# EAGLE design multi-pcb-power (EAGLE 9.6.2)
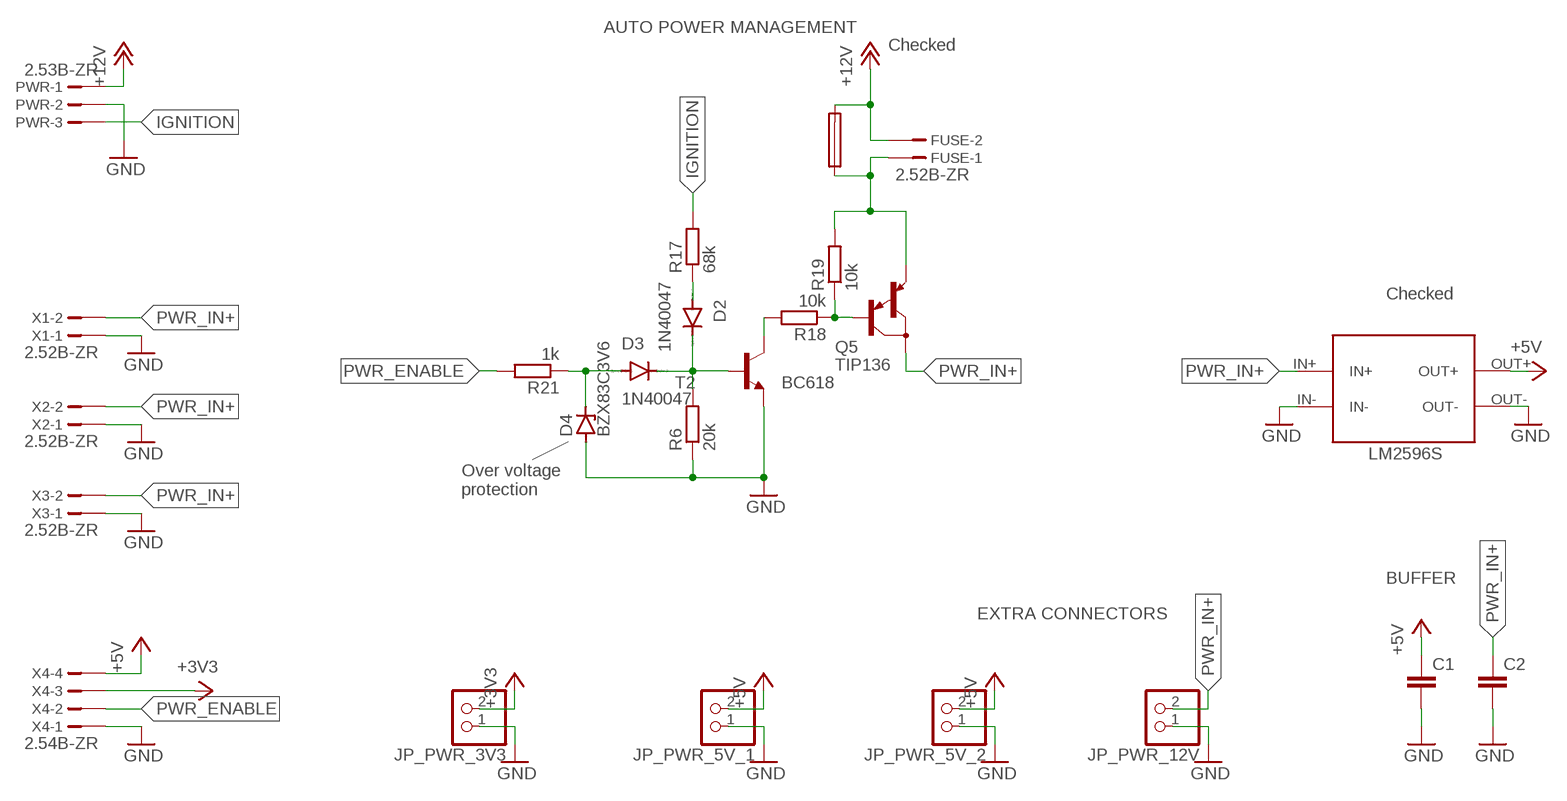
[diagram p0: schematic, sheet 1]

## Parts
C1  C-EU050-075X075  [C050-075X075]
C2  C-EU050-075X075  [C050-075X075]
D2  1N40047  [DO41-7.6]
D3  1N40047  [DO41-7.6]
D4  BZX83C3V6  BZX857  [DO41Z7.6]
FUSE  2.52B-ZR  [B2B-ZR2.5]
JP_PWR_3V3  PINHD-1X2  [1X02]
JP_PWR_5V_1  PINHD-1X2  [1X02]
JP_PWR_5V_2  PINHD-1X2  [1X02]
JP_PWR_12V  PINHD-1X2  [1X02]
PWR  2.53B-ZR  [B3B-ZR2.5]
Q5  TIP136  [TO220]
R6  20k  R-EU_0207/7  [0207/7]
R17  68k  R-EU_0207/7  [0207/7]
R18  10k  R-EU_0207/7  [0207/7]
R19  10k  R-EU_0207/7  [0207/7]
R21  1k  R-EU_0207/7  [0207/7]
T2  BC618  [TO92-EBC]
U$1  FUSE  [FB-5X20]
U$4  LM2596S  [LM2596S]
X1  2.52B-ZR  [B2B-ZR2.5]
X2  2.52B-ZR  [B2B-ZR2.5]
X3  2.52B-ZR  [B2B-ZR2.5]
X4  2.54B-ZR  [B4B-ZR2.5]

## Nets
+3V3: JP_PWR_3V3.2 X4.3
+5V: C1.1 JP_PWR_5V_1.2 JP_PWR_5V_2.2 U$4.OUT+ X4.4
+12V: FUSE.2 PWR.1 U$1.P$3 U$1.P$4
GND: C1.2 C2.2 D4.A JP_PWR_3V3.1 JP_PWR_5V_1.1 JP_PWR_5V_2.1 JP_PWR_12V.1 PWR.2 R6.1 T2.E U$4.IN- U$4.OUT- X1.1 X2.1 X3.1 X4.1
IGNITION: PWR.3 R17.2
N$5: D2.C D3.C R6.2 T2.B
N$11: D3.A D4.C R21.1
N$12: D2.A R17.1
N$14: Q5.1(B) R18.1 R19.1
N$15: R18.2 T2.C
N$21: FUSE.1 Q5.3(E) R19.2 U$1.P$1 U$1.P$2
PWR_ENABLE: R21.2 X4.2
PWR_IN+: C2.1 JP_PWR_12V.2 Q5.2(C) U$4.IN+ X1.2 X2.2 X3.2

## Notes on the sheet
- AUTO POWER MANAGEMENT
- Checked
- Checked
- Over voltage
  protection
- BUFFER
- EXTRA CONNECTORS

## Library data of the parts
C1 C2 = rcl:C-EU: CAPACITOR, European symbol; SPICEPREFIX: C
D2 D3 = diode-custom:1N4004: DIODE general purpose rectifier, 1 A
D4 = diode-custom:BZX85: Z DIODE
FUSE X1-X3 = con-jst-custom:?2B-ZR: ZH CONNECTOR 1.5 mm, 4 pin 1 row Source: http://www.jst.com .. eZH.pdf
JP_PWR_3V3 JP_PWR_5V_1 JP_PWR_5V_2 JP_PWR_12V = pinhead:PINHD-1X2: PIN HEADER
PWR = con-jst-custom:?3B-ZR: ZH CONNECTOR 1.5 mm, 4 pin 1 row Source: http://www.jst.com .. eZH.pdf
Q5 = transistor-pnp:TIP136: PNP Darlington Transistor
R6 R17-R19 R21 = rcl:R-EU_: RESISTOR, European symbol; SPICEPREFIX: R
T2 = transistor-npn:BC618*: NPN Transistor
U$1 = samuel:FUSE
U$4 = samuel:LM2596S
X4 = con-jst-custom:?4B-ZR: ZH CONNECTOR 1.5 mm, 4 pin 1 row Source: http://www.jst.com .. eZH.pdf

## Board
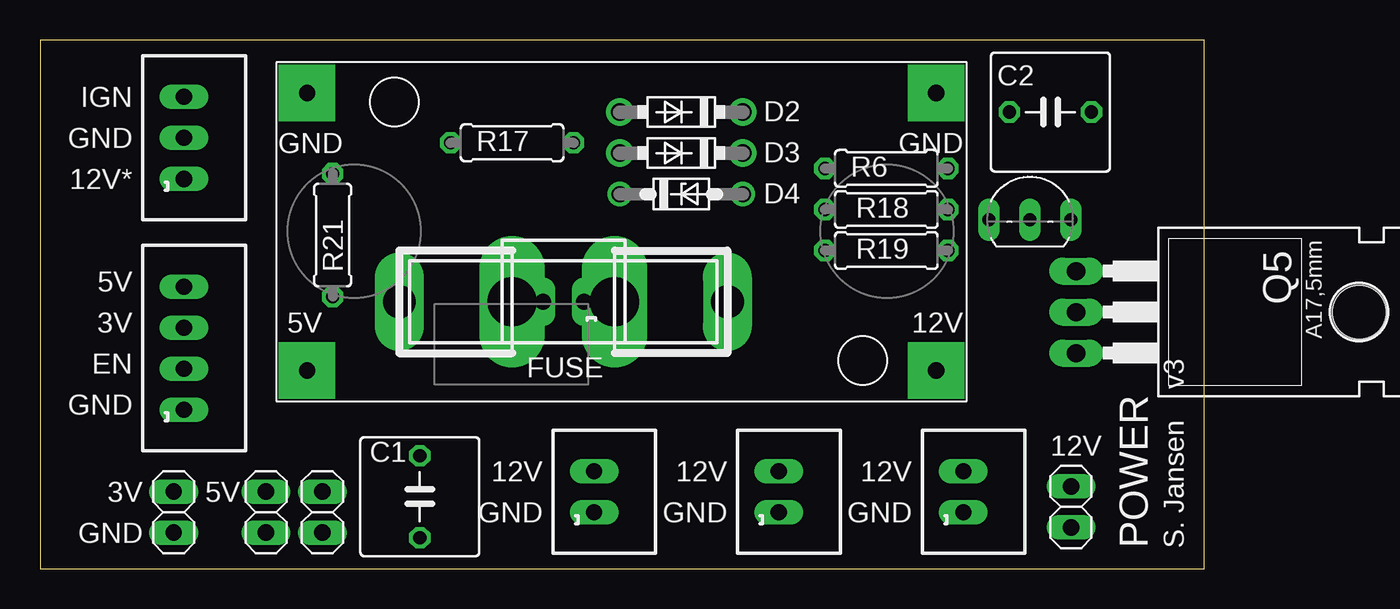
[diagram p1: board, top side]
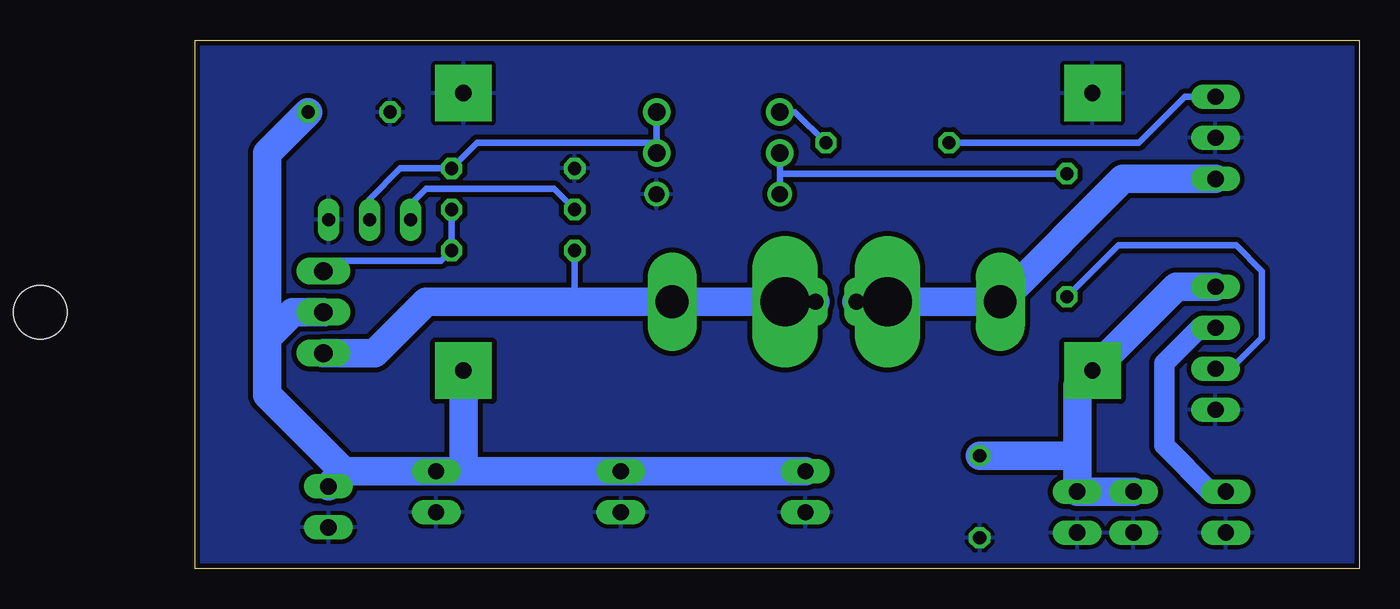
[diagram p2: board, bottom side, seen from below]

Size 72.06 x 32.69 mm. Coordinates in mm from the lower left corner, seen from the top.
Outline: 0,0 72.06,0 72.06,32.69 0,32.69 0,0
Copper layers (1*16): Top 0.035mm / dielectric 1.5mm / Bottom 0.035mm
Design rules "home-made-pcb *": minimum track width 8mil, minimum drill 0.3mm, track to track 12mil, track to pad 8mil, pad to pad 10mil, via to via 10mil, smd to smd 6mil, copper to edge 8mil, drill to drill 10mil, minimum pad ring 10mil, minimum via ring 20mil, stop-mask expansion 4mil, vias tented up to drill 0mil, thermal gap 10mil

### Footprints (pad centres in the part's own frame; a part is rotated, then mirrored left to right if it is on the bottom)
C050-075X075 = drill 0.813 octagon: 1 -2.54,0; 2 2.54,0
DO41-7.6 = drill 1.1 pad 1.7: A 3.81,0; C -3.81,0
DO41Z7.6 = drill 1: A 3.81,0; C -3.81,0
B2B-ZR2.5 = drill 1 pad 1.422 long: 1 -1.285,0; 2 1.257,0
1X02 = drill 1.016 long: 1 -1.27,0; 2 1.27,0
B3B-ZR2.5 = drill 1 pad 1.422 long: 1 -2.555,0; 2 -0.013,0; 3 2.527,0
TO220 = drill 1.118 long: 1 -2.54,-6.35; 2 0,-6.35; 3 2.54,-6.35 | hole 3.302: 0,11.176
0207/7 = drill 0.813 octagon: 1 -3.81,0; 2 3.81,0
TO92-EBC = drill 0.813 long: B 0,-1.27; C -2.54,-1.27; E 2.54,-1.27
FB-5X20 = drill 2.032 long: P$1 -10.16,0; P$4 10.16,0 | drill 3.048 long: P$2 -3.175,0; P$3 3.175,0
LM2596S = drill 1 pad 3.5 square: IN+ -19.633,8.963; IN- -19.633,-8.213; OUT+ 19.323,8.963; OUT- 19.323,-8.213
B4B-ZR2.5 = drill 1 pad 1.422 long: 1 -3.825,0; 2 -1.283,0; 3 1.257,0; 4 3.797,0

### Placement (x,y rotation side)
C1  23.5,4.45 270 top
C2  62.55,28.26 180 top
D2  39.69,28.26 180 top
D3  39.69,25.72 180 top
D4  39.69,23.18 0 top
FUSE  32.38,16.51 180 top
JP_PWR_3V3  8.26,3.49 90 top
JP_PWR_5V_1  17.46,3.49 90 top
JP_PWR_5V_2  13.97,3.49 90 top
JP_PWR_12V  63.82,3.81 90 top
PWR  8.89,26.67 90 top
Q5  70.48,15.88 270 top
R6  52.39,24.77 0 top
R17  29.21,26.35 180 top
R18  52.39,22.23 180 top
R19  52.39,19.68 180 top
R21  18.1,20.64 270 top
T2  61.28,22.86 0 top
U$1  32.38,16.51 180 top
U$4  35.83,21.22 180 top
X1  57.15,4.76 90 top
X2  34.29,4.76 90 top
X3  45.72,4.76 90 top
X4  8.89,13.65 90 top

### Tracks (layer width: path | path; a pad name or v marks a point on that pad's centre or on a via)
+3V3
  Bottom 1.27: X4.3 9.86,14.91 12.06,12.7 12.06,7.62 9.21,4.76 JP_PWR_3V3.2
+5V
  Bottom 1.778: X4.4 11.32,17.45 U$4.OUT+ 17.46,11.3 17.46,6.99 | 17.46,6.99 JP_PWR_5V_1.2 JP_PWR_5V_2.2 | C1.1 17.46,6.99
+12V
  Bottom 1.778: FUSE.2 U$1.P$3 U$1.P$4 14.62,24.11 PWR.1
GND
  pour Bottom (isolate 0.305): -0.64,43.81 -0.64,-0.64 73.03,-0.64 73.03,43.81
  pour Bottom (isolate 0.305): -0.95,-0.95 74.3,-0.95 74.3,35.56 -0.95,35.56
IGNITION
  Bottom 0.406: PWR.3 10.81,29.2 13.65,26.35 R17.2
N$5
  Bottom 0.406: D2.C 43.5,26.35 | 43.5,26.35 D3.C | 43.5,26.35 54.61,26.35 R6.2 59.37,24.77 61.28,22.86 T2.B
N$11
  Bottom 0.406: R21.1 35.88,24.45 | 35.88,24.45 D3.A | 35.88,24.45 D4.C
N$12
  Bottom 0.406: 35.24,28.26 D2.A 34.92,28.26 R17.1
N$14
  Bottom 0.406: Q5.1 63.5,19.05 56.83,19.05 R19.1 R18.1
N$15
  Bottom 0.406: R18.2 49.85,23.5 57.78,23.5 58.74,22.54 T2.C
N$21
  Bottom 0.406: R19.2 48.58,16.51
  Bottom 1.778: FUSE.1 U$1.P$2 U$1.P$1 48.58,16.51 57.78,16.51 60.96,13.34 Q5.3
PWR_ENABLE
  Bottom 0.406: X4.2 7.95,12.37 6.03,14.29 6.03,18.41 7.62,20 14.92,20 R21.2
PWR_IN+
  Bottom 1.778: X2.2 X3.2 55.56,6.02 | 55.56,6.02 X1.2 62.88,6.02 | 62.88,6.02 JP_PWR_12V.2 | U$4.IN+ 55.47,6.12 55.56,6.02 | Q5.2 66.04,15.88 67.63,14.29 | 62.88,6.02 67.63,10.77 67.63,14.29 | C2.1 67.63,25.72 67.63,14.29

### Text on the board
tPlace: v3 | POWER | S. Jansen
tNames: IGN | GND | GND | GND | 12V* | 5V | 3V | 5V | 12V | EN | GND | 12V | 12V | 12V | 12V | 3V | 5V | GND | GND | GND | GND